# Altium project LAMP Microcontroller PCB.PrjPCB
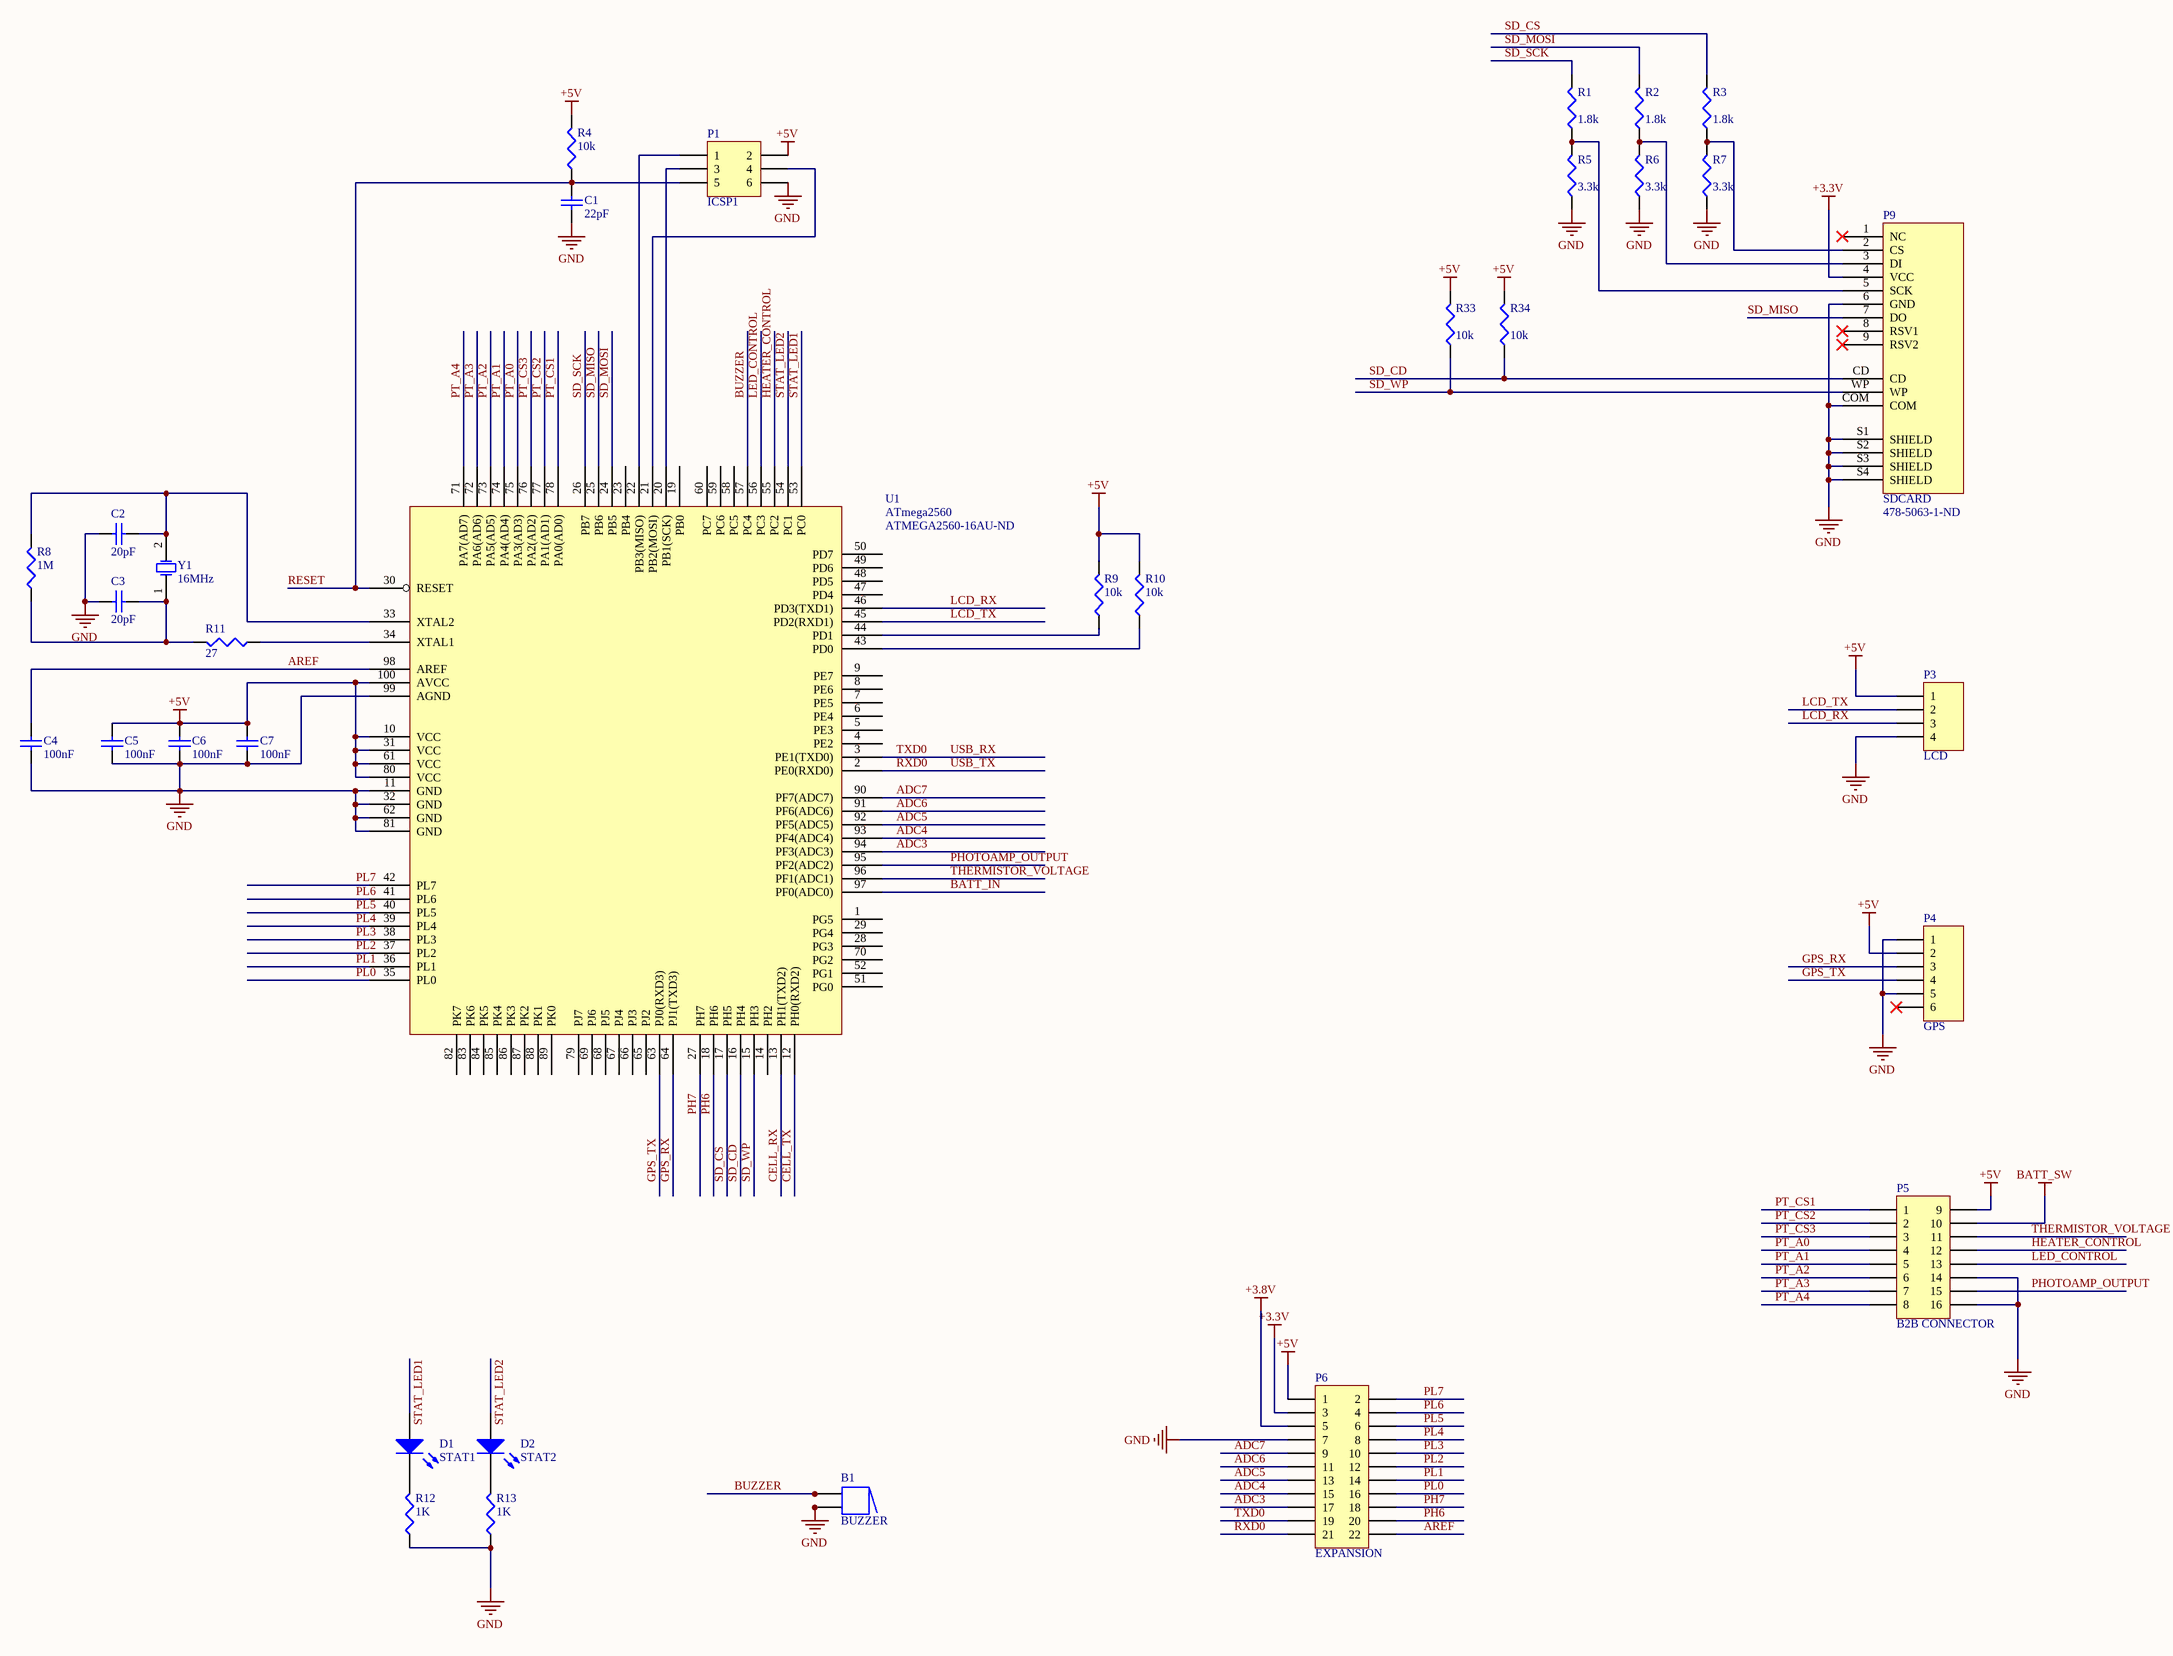
[diagram p0: Arduino Board.SchDoc]
4 sheets, 88 parts. Net scope: global (net labels, ports and power ports of the same name join across sheets).
Board file: Microcontroller PCB.PcbDoc
Sheets:
  Arduino Board.SchDoc
  Power Circuits.SchDoc
  Cell Phone Module.SchDoc
  USB Host.SchDoc

## Sheet Arduino Board.SchDoc
size C

### Parts
B1  BUZZER  [BUZZER]
C1  value 22pF  [C1206]  (hidden comment: Cap Semi)
C2  value 20pF  [C1206]  (hidden comment: Cap Semi)
C3  value 20pF  [C1206]  (hidden comment: Cap Semi)
C4  value 100nF  [C1206]  (hidden comment: Cap Semi)
C5  value 100nF  [C1206]  (hidden comment: Cap Semi)
C6  value 100nF  [C1206]  (hidden comment: Cap Semi)
C7  value 100nF  [C1206]  (hidden comment: Cap Semi)
D1  STAT1  [HDR1X2]
D2  STAT2  [HDR1X2]
P1  ICSP1  [HDR2X3]
P3  LCD  [2MM JST PH - 4 PIN]
P4  GPS  [2mm JST PH - 6 pin]
P5  B2B CONNECTOR  [HDR2X8_CEN]
P6  EXPANSION  [HDR2X11]
P9  SDCARD  Supplier Part Number 1: 478-5063-1-ND  [SDSLOT]
R1  value 1.8k  [RESC3216M]  (hidden comment: Res3)
R2  value 1.8k  [RESC3216M]  (hidden comment: Res3)
R3  value 1.8k  [RESC3216M]  (hidden comment: Res3)
R4  value 10k  [RESC3216M]  (hidden comment: Res3)
R5  value 3.3k  [RESC3216M]  (hidden comment: Res3)
R6  value 3.3k  [RESC3216M]  (hidden comment: Res3)
R7  value 3.3k  [RESC3216M]  (hidden comment: Res3)
R8  value 1M  [RESC3216M]  (hidden comment: Res3)
R9  value 10k  [RESC3216M]  (hidden comment: Res3)
R10  value 10k  [RESC3216M]  (hidden comment: Res3)
R11  value 27  [RESC3216M]  (hidden comment: Res3)
R12  value 1K  [RESC3216M]  (hidden comment: Res3)
R13  value 1K  [RESC3216M]  (hidden comment: Res3)
R33  value 10k  [RESC3216M]  (hidden comment: Res3)
R34  value 10k  [RESC3216M]  (hidden comment: Res3)
U1  ATmega2560  Supplier Part Number 1: ATMEGA2560-16AU-ND  [TSQFP50P1600X1600-100M]
Y1  16MHz  [SMT Crystal]

### Nets
+3.3V: P6.3 P9.4(VCC)
+3.8V: P6.5
+5V: C5.2 C6.2 C7.2 P1.2 P3.1 P4.2 P5.9 P6.1 R4.2 R9.2 R10.2 R33.2 R34.2 U1.10(VCC) U1.31(VCC) U1.61(VCC) U1.80(VCC) U1.100(AVCC)
BATT_SW: P5.10
GND: B1.2 B1.2A C1.1 C2.1 C3.2 C4.1 C5.1 C6.1 C7.1 P1.6 P3.4 P4.1 P4.5 P5.14 P5.16 P6.7 P9.6(GND) P9.COM P9.S1(SHIELD) P9.S2(SHIELD) P9.S3(SHIELD) P9.S4(SHIELD) R5.1 R6.1 R7.1 R12.1 R13.1 U1.11(GND) U1.32(GND) U1.62(GND) U1.81(GND) U1.99(AGND)
ADC3: P6.17 U1.94(PF3(ADC3))
ADC4: P6.15 U1.93(PF4(ADC4))
ADC5: P6.13 U1.92(PF5(ADC5))
ADC6: P6.11 U1.91(PF6(ADC6))
ADC7: P6.9 U1.90(PF7(ADC7))
AREF: C4.2 P6.22 U1.98(AREF)
BATT_IN: U1.97(PF0(ADC0))
BUZZER: B1.1 B1.1A U1.57(PC4)
CELL_RX: U1.13(PH1(TXD2))
CELL_TX: U1.12(PH0(RXD2))
GPS_RX: P4.3 U1.64(PJ1(TXD3))
GPS_TX: P4.4 U1.63(PJ0(RXD3))
HEATER_CONTROL: P5.12 U1.55(PC2)
LCD_RX: P3.3 U1.46(PD3(TXD1))
LCD_TX: P3.2 U1.45(PD2(RXD1))
LED_CONTROL: P5.13 U1.56(PC3)
PH6: P6.20 U1.18(PH6)
PH7: P6.18 U1.27(PH7)
PHOTOAMP_OUTPUT: P5.15 U1.95(PF2(ADC2))
PL0: P6.16 U1.35(PL0)
PL1: P6.14 U1.36(PL1)
PL2: P6.12 U1.37(PL2)
PL3: P6.10 U1.38(PL3)
PL4: P6.8 U1.39(PL4)
PL5: P6.6 U1.40(PL5)
PL6: P6.4 U1.41(PL6)
PL7: P6.2 U1.42(PL7)
PT_A0: P5.4 U1.75(PA3(AD3))
PT_A1: P5.5 U1.74(PA4(AD4))
PT_A2: P5.6 U1.73(PA5(AD5))
PT_A3: P5.7 U1.72(PA6(AD6))
PT_A4: P5.8 U1.71(PA7(AD7))
PT_CS1: P5.1 U1.78(PA0(AD0))
PT_CS2: P5.2 U1.77(PA1(AD1))
PT_CS3: P5.3 U1.76(PA2(AD2))
RESET: C1.2 P1.5 R4.1 U1.30(RESET)
RXD0: P6.21 U1.2(PE0(RXD0))  [also labelled USB_TX]
SD_CD: P9.CD R34.1 U1.16(PH4)
SD_CS: R3.2 U1.17(PH5)
SD_MISO: P9.7(DO) U1.25(PB6)
SD_MOSI: R2.2 U1.24(PB5)
SD_SCK: R1.2 U1.26(PB7)
SD_WP: P9.WP R33.1 U1.15(PH3)
STAT_LED1: D1.1(A) U1.53(PC0)
STAT_LED2: D2.1(A) U1.54(PC1)
THERMISTOR_VOLTAGE: P5.11 U1.96(PF1(ADC1))
TXD0: P6.19 U1.3(PE1(TXD0))  [also labelled USB_RX]
NetC2_2: C2.2 R8.2 U1.33(XTAL2) Y1.2(OSC2)
NetC3_1: C3.1 R8.1 R11.2 Y1.1(OSC1)
NetD1_2: D1.2(K) R12.2
NetD2_2: D2.2(K) R13.2
NetP1_1: P1.1 U1.22(PB3(MISO))
NetP1_3: P1.3 U1.20(PB1(SCK))
NetP1_4: P1.4 U1.21(PB2(MOSI))
NetP9_2: P9.2(CS) R3.1 R7.2
NetP9_3: P9.3(DI) R2.1 R6.2
NetP9_5: P9.5(SCK) R1.1 R5.2
NetR9_1: R9.1 U1.44(PD1)
NetR10_1: R10.1 U1.43(PD0)
NetR11_1: R11.1 U1.34(XTAL1)

Not connected (* = marked no-connect by the designer): P4 6*; P9 1(NC)* 8(RSV1)* 9(RSV2)*; U1 1(PG5) 4(PE2) 5(PE3) 6(PE4) 7(PE5) 8(PE6) 9(PE7) 14(PH2) 19(PB0) 23(PB4) 28(PG3) 29(PG4) 47(PD4) 48(PD5) 49(PD6) 50(PD7) 51(PG0) 52(PG1) 58(PC5) 59(PC6) 60(PC7) 65(PJ2) 66(PJ3) 67(PJ4) 68(PJ5) 69(PJ6) 70(PG2) 79(PJ7) 82(PK7) 83(PK6) 84(PK5) 85(PK4) 86(PK3) 87(PK2) 88(PK1) 89(PK0)

### Library data of the parts
B1 = Buzzer: Magnetic Transducer Buzzer; pin to pad: 1A>1 2A>2; Published: 24-Mar-1999; LatestRevisionDate: 17-Dec-2003; LatestRevisionNote: Schematic revised, PCB Footprint replaced.; DatasheetVersion: 17-Dec-2003; PackageReference: ABSM-1574; Publisher: Altium Limited; PackageDescription: Magnetic Transducer Buzzer; ComponentLink1Description: Manufacturer Link; ComponentLink1URL: http://www.megastar.com/linecard/buzzmode/index.php
C1-C7 = Cap Semi: Capacitor (Semiconductor SIM Model); Published: 8-Jun-2000; LatestRevisionDate: 29-May-2009; LatestRevisionNote: IPC-7351 Footprint Added.; PackageReference: C1206; Publisher: Altium Limited; PackageDescription: Chip Capacitor
D1 D2 = LED3: Typical BLUE SiC LED; Published: 8-Jun-2000; LatestRevisionDate: 17-Dec-2003; LatestRevisionNote: PCB Footprint replaced.; DatasheetVersion: 16-Apr-2002; PackageVersion: 16-Apr-2002; PackageReference: 3.5X2.8X1.9; Publisher: Altium Limited; PackageDescription: SM LED; 2 C-Bend Leads; Body 3.5 x 2.8 x 1.9 mm, inc leads (LxWxH typ)
P1 = Header 3X2: Header, 3-Pin, Dual row; LatestRevisionDate: 17-Jul-2002; LatestRevisionNote: Re-released for DXP Platform.; Publisher: Altium Limited
P3 = Header 4: Header, 4-Pin; LatestRevisionDate: 17-Jul-2002; LatestRevisionNote: Re-released for DXP Platform.; Publisher: Altium Limited
P4 = Header 6: Header, 6-Pin; LatestRevisionDate: 17-Jul-2002; LatestRevisionNote: Re-released for DXP Platform.; Publisher: Altium Limited
P5 = Header 8X2A: Header, 8-Pin, Dual row; LatestRevisionDate: 17-Jul-2002; LatestRevisionNote: Re-released for DXP Platform.; Publisher: Altium Limited
P6 = Header 11X2: Header, 11-Pin, Dual row; LatestRevisionDate: 17-Jul-2002; LatestRevisionNote: Re-released for DXP Platform.; Publisher: Altium Limited
P9 = SDSLOT: Supplier 1: Digi-Key
R1-R13 R33 R34 = Res3: Resistor; Published: 8-Jun-2000; LatestRevisionDate: 29-May-2009; LatestRevisionNote: IPC-7351 Footprint Added.; PackageReference: J1-0603; Publisher: Altium Limited; PackageDescription: Chip Resistor
Y1 = XTAL: Crystal Oscillator; Published: 8-Jun-2000; LatestRevisionDate: 17-Jul-2002; LatestRevisionNote: Re-released for DXP Platform.; PackageReference: R38; Publisher: Altium Limited; PackageDescription: Crystal, Thru-Hole; 2 Leads; Body 3.1 x 8.2 mm (Dia.xH)
U1 = ATmega2560: Supplier 1: Digi-Key

## Sheet Power Circuits.SchDoc
size A
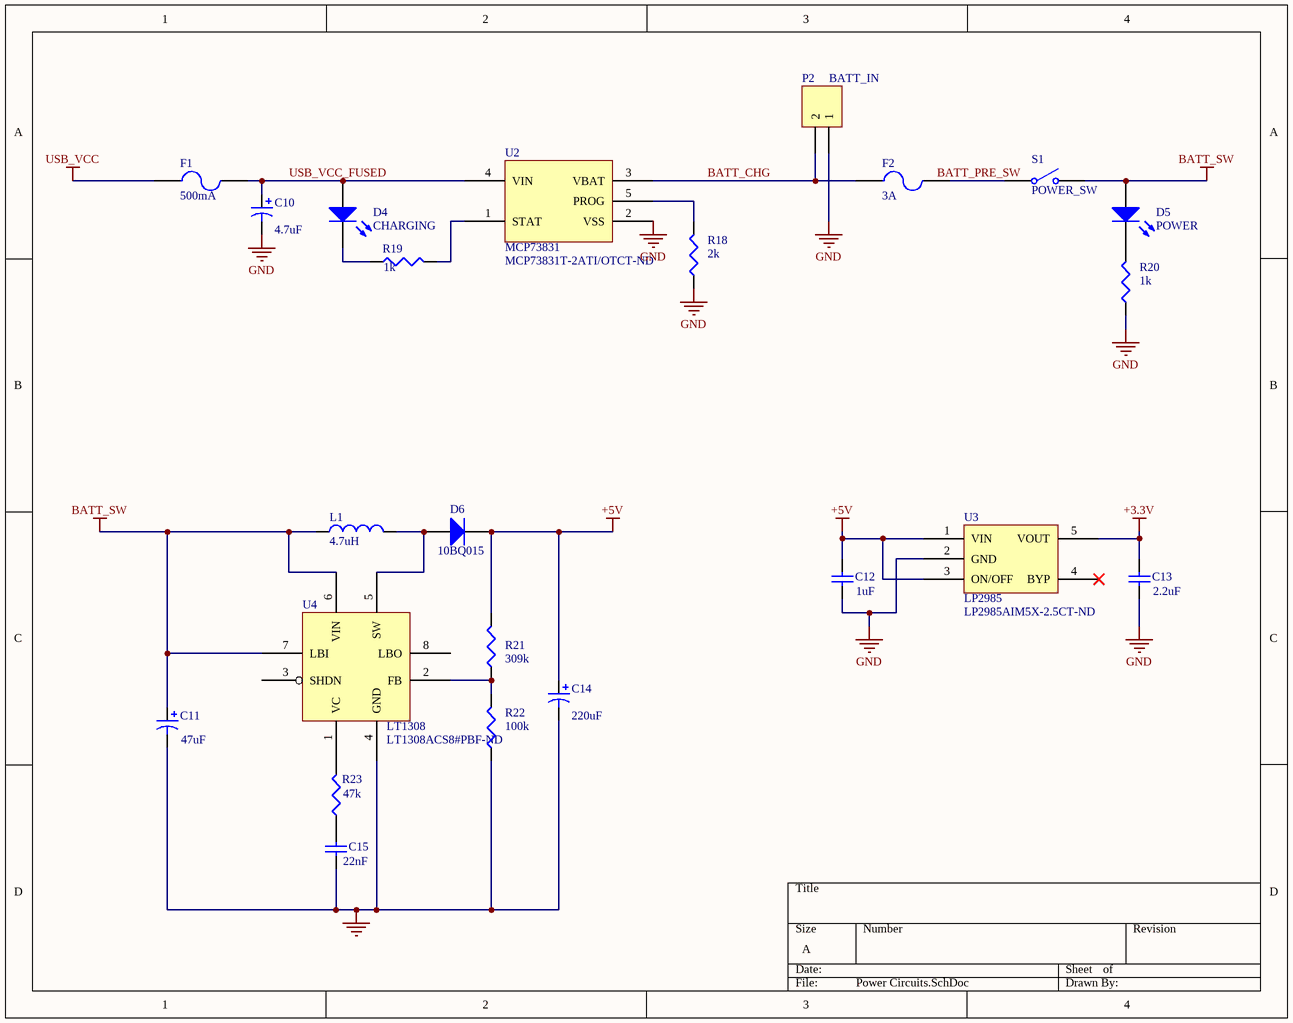
[diagram p1: Power Circuits.SchDoc]

### Parts
C10  value 4.7uF  [TC7343-2917]  (hidden comment: Cap Pol3)
C11  value 47uF  [TC6032-2412]  (hidden comment: Cap Pol3)
C12  value 1uF  [C1206]  (hidden comment: Cap Semi)
C13  value 2.2uF  [C1206]  (hidden comment: Cap Semi)
C14  value 220uF  [TC7343-2917]  (hidden comment: Cap Pol3)
C15  value 22nF  [C1206]  (hidden comment: Cap Semi)
D4  CHARGING  [HDR1X2]
D5  POWER  [HDR1X2]
D6  10BQ015  [DSO-C2/X2.3]
F1  500mA  [RESC3216M]
F2  3A  [RESC3216M]
L1  value 4.7uH  [MURATA SMT INDUCTOR]  (hidden comment: Inductor)
P2  BATT_IN  [2MM JST PH - 2 PIN VERT]
R18  value 2k  [RESC3216M]  (hidden comment: Res3)
R19  value 1k  [RESC3216M]  (hidden comment: Res3)
R20  value 1k  [RESC3216M]  (hidden comment: Res3)
R21  value 309k  [RESC3216M]  (hidden comment: Res3)
R22  value 100k  [RESC3216M]  (hidden comment: Res3)
R23  value 47k  [RESC3216M]  (hidden comment: Res3)
S1  POWER_SW  [DPDT_PUSHBUTTON_SWITCH]
U2  MCP73831  Supplier Part Number 1: MCP73831T-2ATI/OTCT-ND  [SOT23-5AM]
U3  LP2985  Supplier Part Number 1: LP2985AIM5X-2.5CT-ND  [SOT23-5AM]
U4  LT1308  Supplier Part Number 1: LT1308ACS8#PBF-ND  [SOIC127P600-8AM]

### Nets
+3.3V: C13.2 U3.5(VOUT)
+5V: C12.2 C14.1 D6.2(K) R21.2 U3.1(VIN) U3.3(ON/OFF)
BATT_SW: C11.1 D5.1(A) L1.1 S1.2(NO) U4.6(VIN) U4.7(LBI)
GND: C10.2 C11.2 C12.1 C13.1 C14.2 C15.1 P2.1 R18.1 R20.1 R22.1 U2.2(VSS) U3.2(GND) U4.4(GND)
USB_VCC: F1.1
BATT_CHG: F2.1 P2.2 U2.3(VBAT)
USB_VCC_FUSED: C10.1 D4.1(A) F1.2 U2.4(VIN)
NetC15_2: C15.2 R23.1
NetD4_2: D4.2(K) R19.1
NetD5_2: D5.2(K) R20.2
NetD6_1: D6.1(A) L1.2 U4.5(SW)
NetF2_2: F2.2 S1.1(COMMON)
NetR18_2: R18.2 U2.5(PROG)
NetR19_2: R19.2 U2.1(STAT)
NetR21_1: R21.1 R22.2 U4.2(FB)
NetR23_2: R23.2 U4.1(VC)

Not connected (* = marked no-connect by the designer): U3 4(BYP)*; U4 3(SHDN) 8(LBO)

### Notes on the sheet
- Labels drawn without touching a wire or pin: BATT_PRE_SW

### Library data of the parts
C10 C11 C14 = Cap Pol3: Polarized Capacitor (Surface Mount); Published: 8-Jun-2000; LatestRevisionDate: 29-May-2009; LatestRevisionNote: IPC-7351 Footprint Added.; PackageReference: C0805; Publisher: Altium Limited; PackageDescription: Chip Capacitor
C12 C13 C15 = Cap Semi: Capacitor (Semiconductor SIM Model); Published: 8-Jun-2000; LatestRevisionDate: 29-May-2009; LatestRevisionNote: IPC-7351 Footprint Added.; PackageReference: C1206; Publisher: Altium Limited; PackageDescription: Chip Capacitor
D4 D5 = LED3: Typical BLUE SiC LED; Published: 8-Jun-2000; LatestRevisionDate: 17-Dec-2003; LatestRevisionNote: PCB Footprint replaced.; DatasheetVersion: 16-Apr-2002; PackageVersion: 16-Apr-2002; PackageReference: 3.5X2.8X1.9; Publisher: Altium Limited; PackageDescription: SM LED; 2 C-Bend Leads; Body 3.5 x 2.8 x 1.9 mm, inc leads (LxWxH typ)
D6 = Diode: Default Diode; Published: 8-Jun-2000; LatestRevisionDate: 17-Jul-2002; LatestRevisionNote: Re-released for DXP Platform.; PackageVersion: Sep-1996; PackageReference: SMC; Publisher: Altium Limited; PackageDescription: DO-214-AB/SMC; 2 C-Bend Leads; Body 7.9 x 5.9 mm, inc. leads (LxW); Code_JEDEC: DO-214-AB
F1 F2 = Fuse 2: Fuse; Published: 8-Jun-2000; LatestRevisionDate: 17-Jul-2002; LatestRevisionNote: Re-released for DXP Platform.; PackageReference: PIN-W2/E2.8; Publisher: Altium Limited; PackageDescription: Thru-Hole; 2 Leads
L1 = Inductor: Code_IEC: 1005; Published: 8-Jun-2000; LatestRevisionDate: 29-May-2009; LatestRevisionNote: IPC-7351 Footprint Added.; PackageReference: 0402-A; Publisher: Altium Limited; PackageDescription: Chip Inductor; Code_JEITA: 0402
P2 = Header 2: Header, 2-Pin; LatestRevisionDate: 17-Jul-2002; LatestRevisionNote: Re-released for DXP Platform.; Publisher: Altium Limited
R18-R23 = Res3: Resistor; Published: 8-Jun-2000; LatestRevisionDate: 29-May-2009; LatestRevisionNote: IPC-7351 Footprint Added.; PackageReference: J1-0603; Publisher: Altium Limited; PackageDescription: Chip Resistor
S1 = SW-SPST: Single-Pole, Single-Throw Switch; pin to pad: 1>D 2>S2; Published: 24-Mar-1999; LatestRevisionDate: 17-Jul-2002; LatestRevisionNote: Re-released for DXP Platform.; PackageReference: SPST-2; Publisher: Altium Limited; PackageDescription: Switch; 2 Leads
U2 = MCP73831: Supplier 1: Digi-Key
U3 = LP2985: Supplier 1: Digi-Key
U4 = LT1308: Supplier 1: Digi-Key

## Sheet Cell Phone Module.SchDoc
size A
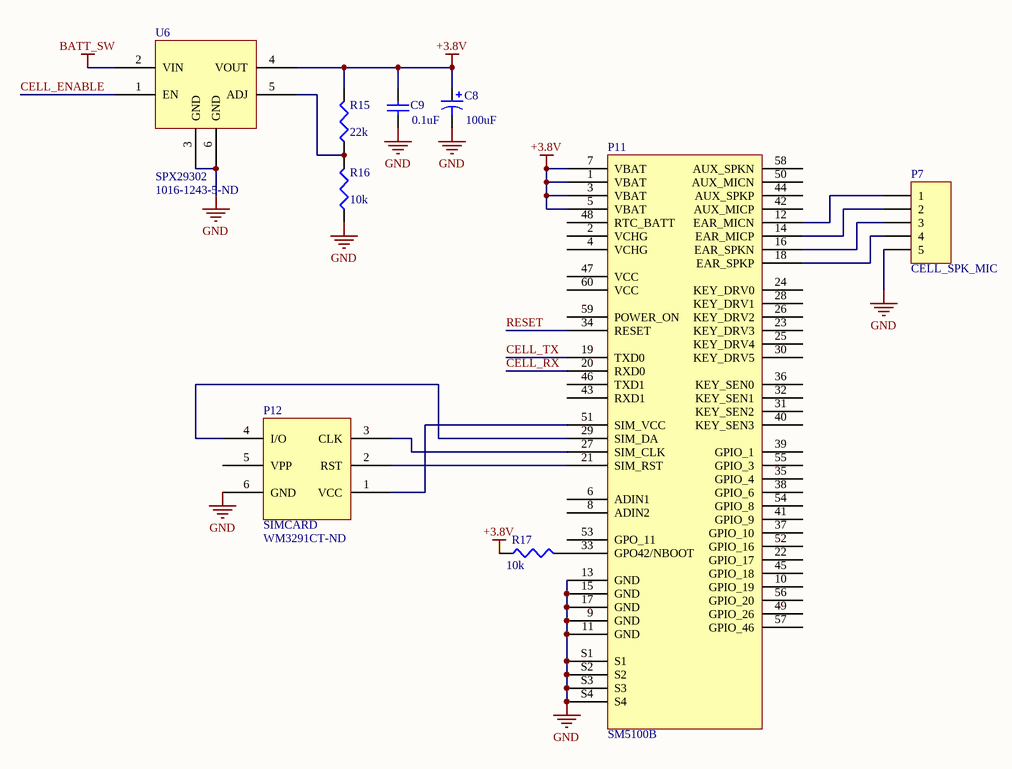
[diagram p2: Cell Phone Module.SchDoc]

### Parts
C8  value 100uF  [TC7343-2917]  (hidden comment: Cap Pol3)
C9  value 0.1uF  [C1206]  (hidden comment: Cap Semi)
P7  CELL_SPK_MIC  [2mm JST PH - 5 pin]
P11  SM5100B  [SM5100B-60PIN]
P12  SIMCARD  Supplier Part Number 1: WM3291CT-ND  [SIMSLOT]
R15  value 22k  [RESC3216M]  (hidden comment: Res3)
R16  value 10k  [RESC3216M]  (hidden comment: Res3)
R17  value 10k  [RESC3216M]  (hidden comment: Res3)
U6  SPX29302  Supplier Part Number 1: 1016-1243-5-ND  [TO170P1520-6N]

### Nets
+3.8V: C8.1 C9.2 P11.1(VBAT) P11.3(VBAT) P11.5(VBAT) P11.7(VBAT) R15.2 R17.1 U6.4(VOUT)
BATT_SW: U6.2(VIN)
GND: C8.2 C9.1 P7.5 P11.9(GND) P11.11(GND) P11.13(GND) P11.15(GND) P11.17(GND) P11.S1 P11.S2 P11.S3 P11.S4 P12.6(GND) R16.1 U6.3(GND) U6.6(GND)
CELL_ENABLE: U6.1(EN)
CELL_RX: P11.20(RXD0)
CELL_TX: P11.19(TXD0)
RESET: P11.34(RESET)
NetP7_1: P7.1 P11.12(EAR_MICN)
NetP7_2: P7.2 P11.14(EAR_MICP)
NetP7_3: P7.3 P11.16(EAR_SPKN)
NetP7_4: P7.4 P11.18(EAR_SPKP)
NetP11_21: P11.21(SIM_RST) P12.2(RST)
NetP11_27: P11.27(SIM_CLK) P12.3(CLK)
NetP11_29: P11.29(SIM_DA) P12.4(I/O)
NetP11_33: P11.33(GPO42/NBOOT) R17.2
NetP11_51: P11.51(SIM_VCC) P12.1(VCC)
NetR15_1: R15.1 R16.2 U6.5(ADJ)

Not connected (* = marked no-connect by the designer): P11 2(VCHG) 4(VCHG) 6(ADIN1) 8(ADIN2) 10(GPIO_19) 22(GPIO_17) 23(KEY_DRV3) 24(KEY_DRV0) 25(KEY_DRV4) 26(KEY_DRV2) 28(KEY_DRV1) 30(KEY_DRV5) 31(KEY_SEN2) 32(KEY_SEN1) 35(GPIO_4) 36(KEY_SEN0) 37(GPIO_10) 38(GPIO_6) 39(GPIO_1) 40(KEY_SEN3) 41(GPIO_9) 42(AUX_MICP) 43(RXD1) 44(AUX_SPKP) 45(GPIO_18) 46(TXD1) 47(VCC) 48(RTC_BATT) 49(GPIO_26) 50(AUX_MICN) 52(GPIO_16) 53(GPO_11) 54(GPIO_8) 55(GPIO_3) 56(GPIO_20) 57(GPIO_46) 58(AUX_SPKN) 59(POWER_ON) 60(VCC); P12 5(VPP)

### Library data of the parts
C8 = Cap Pol3: Polarized Capacitor (Surface Mount); Published: 8-Jun-2000; LatestRevisionDate: 29-May-2009; LatestRevisionNote: IPC-7351 Footprint Added.; PackageReference: C0805; Publisher: Altium Limited; PackageDescription: Chip Capacitor
C9 = Cap Semi: Capacitor (Semiconductor SIM Model); Published: 8-Jun-2000; LatestRevisionDate: 29-May-2009; LatestRevisionNote: IPC-7351 Footprint Added.; PackageReference: C1206; Publisher: Altium Limited; PackageDescription: Chip Capacitor
P7 = Header 5: Header, 5-Pin; LatestRevisionDate: 17-Jul-2002; LatestRevisionNote: Re-released for DXP Platform.; Publisher: Altium Limited
P12 = SIMHOLDER: Supplier 1: Digi-Key
R15-R17 = Res3: Resistor; Published: 8-Jun-2000; LatestRevisionDate: 29-May-2009; LatestRevisionNote: IPC-7351 Footprint Added.; PackageReference: J1-0603; Publisher: Altium Limited; PackageDescription: Chip Resistor
U6 = SPX29302: Supplier 1: Digi-Key

## Sheet USB Host.SchDoc
size A
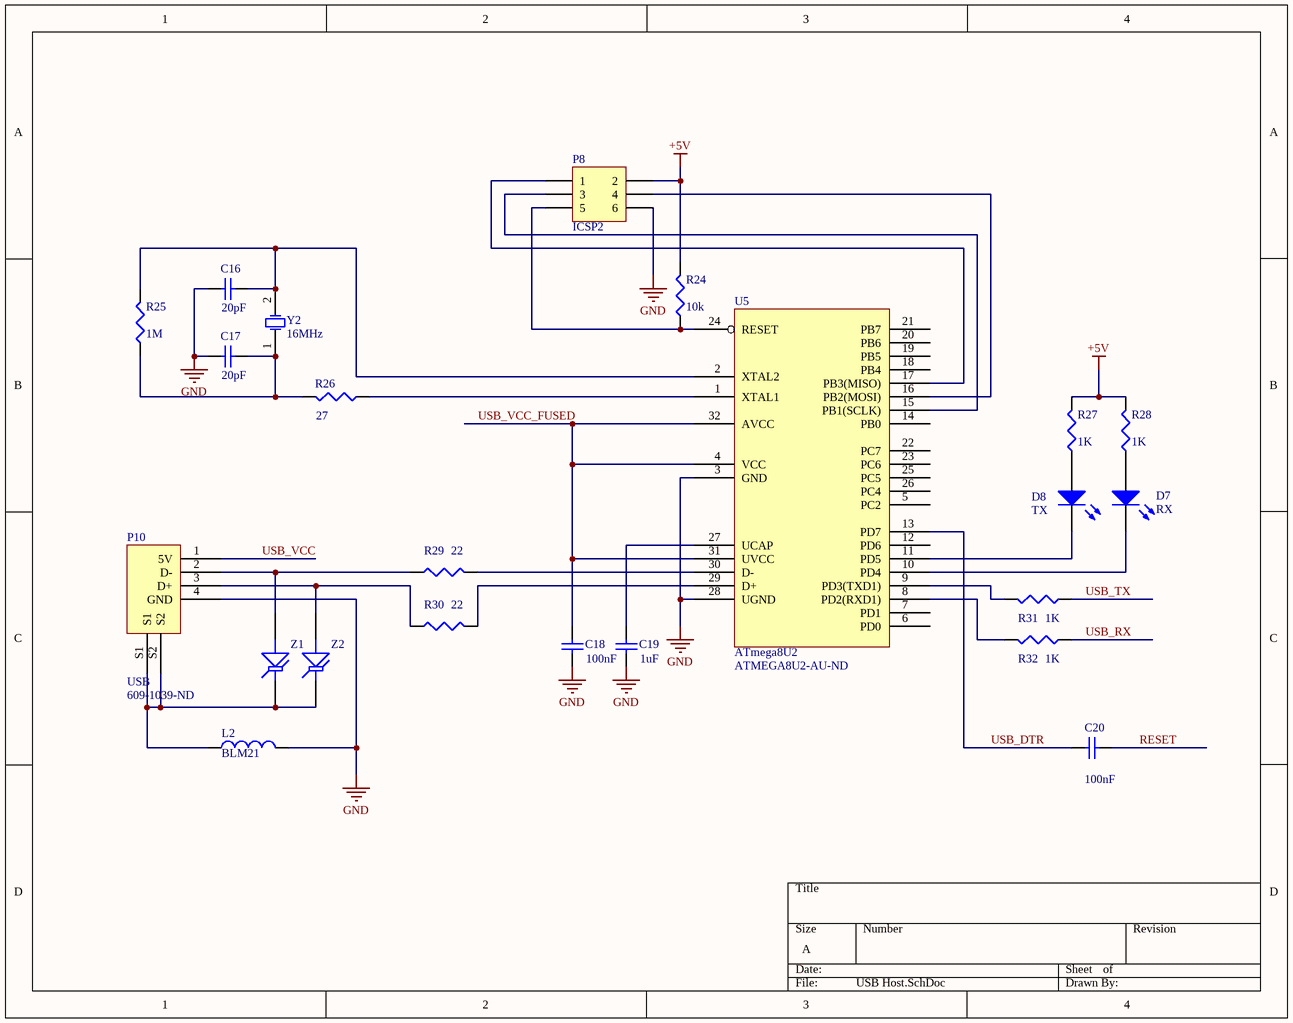
[diagram p3: USB Host.SchDoc]

### Parts
C16  value 20pF  [C1206]  (hidden comment: Cap Semi)
C17  value 20pF  [C1206]  (hidden comment: Cap Semi)
C18  value 100nF  [C1206]  (hidden comment: Cap Semi)
C19  value 1uF  [C1206]  (hidden comment: Cap Semi)
C20  value 100nF  [C1206]  (hidden comment: Cap Semi)
D7  RX  [HDR1X2]
D8  TX  [HDR1X2]
L2  value BLM21  [INDC2012M]  (hidden comment: Inductor)
P8  ICSP2  [HDR2X3]
P10  USB  Supplier Part Number 1: 609-1039-ND  [USB-B PN61729]
R24  value 10k  [RESC3216M]  (hidden comment: Res3)
R25  value 1M  [RESC3216M]  (hidden comment: Res3)
R26  value 27  [RESC3216M]  (hidden comment: Res3)
R27  value 1K  [RESC3216M]  (hidden comment: Res3)
R28  value 1K  [RESC3216M]  (hidden comment: Res3)
R29  value 22  [RESC3216M]  (hidden comment: Res3)
R30  value 22  [RESC3216M]  (hidden comment: Res3)
R31  value 1K  [RESC3216M]  (hidden comment: Res3)
R32  value 1K  [RESC3216M]  (hidden comment: Res3)
U5  ATmega8U2  Supplier Part Number 1: ATMEGA8U2-AU-ND  [QFP80P900X900-32M]
Y2  16MHz  [SMT Crystal]
Z1  Tranzorb  [CD1608-0603]  (value not drawn)
Z2  Tranzorb  [CD1608-0603]  (value not drawn)

### Nets
+5V: P8.2 R24.2 R27.2 R28.2
GND: C16.1 C17.2 C18.1 C19.1 L2.2 P8.6 P10.4(GND) U5.3(GND) U5.28(UGND)
USB_VCC: P10.1(5V)
RESET: C20.2
USB_DTR: C20.1 U5.13(PD7)
USB_RX: R32.1  [project net TXD0]
USB_TX: R31.1  [project net RXD0]
USB_VCC_FUSED: C18.2 U5.4(VCC) U5.31(UVCC) U5.32(AVCC)
NetC16_2: C16.2 R25.2 U5.2(XTAL2) Y2.2(OSC2)
NetC17_1: C17.1 R25.1 R26.2 Y2.1(OSC1)
NetC19_2: C19.2 U5.27(UCAP)
NetD7_1: D7.1(A) R28.1
NetD7_2: D7.2(K) U5.10(PD4)
NetD8_1: D8.1(A) R27.1
NetD8_2: D8.2(K) U5.11(PD5)
NetL2_1: L2.1 P10.S1 P10.S2 Z1.2(K) Z2.2(K)
NetP8_1: P8.1 U5.17(PB3(MISO))
NetP8_3: P8.3 U5.15(PB1(SCLK))
NetP8_4: P8.4 U5.16(PB2(MOSI))
NetP8_5: P8.5 R24.1 U5.24(RESET)
NetP10_2: P10.2(D-) R29.1 Z1.1(A)
NetP10_3: P10.3(D+) R30.1 Z2.1(A)
NetR26_1: R26.1 U5.1(XTAL1)
NetR29_2: R29.2 U5.30(D-)
NetR30_2: R30.2 U5.29(D+)
NetR31_2: R31.2 U5.9(PD3(TXD1))
NetR32_2: R32.2 U5.8(PD2(RXD1))

Not connected (* = marked no-connect by the designer): U5 5(PC2) 6(PD0) 7(PD1) 12(PD6) 14(PB0) 18(PB4) 19(PB5) 20(PB6) 21(PB7) 22(PC7) 23(PC6) 25(PC5) 26(PC4)

### Library data of the parts
C16-C20 = Cap Semi: Capacitor (Semiconductor SIM Model); Published: 8-Jun-2000; LatestRevisionDate: 29-May-2009; LatestRevisionNote: IPC-7351 Footprint Added.; PackageReference: C1206; Publisher: Altium Limited; PackageDescription: Chip Capacitor
D7 D8 = LED3: Typical BLUE SiC LED; Published: 8-Jun-2000; LatestRevisionDate: 17-Dec-2003; LatestRevisionNote: PCB Footprint replaced.; DatasheetVersion: 16-Apr-2002; PackageVersion: 16-Apr-2002; PackageReference: 3.5X2.8X1.9; Publisher: Altium Limited; PackageDescription: SM LED; 2 C-Bend Leads; Body 3.5 x 2.8 x 1.9 mm, inc leads (LxWxH typ)
L2 = Inductor: Code_IEC: 1005; Published: 8-Jun-2000; LatestRevisionDate: 29-May-2009; LatestRevisionNote: IPC-7351 Footprint Added.; PackageReference: 0402-A; Publisher: Altium Limited; PackageDescription: Chip Inductor; Code_JEITA: 0402
P8 = Header 3X2: Header, 3-Pin, Dual row; LatestRevisionDate: 17-Jul-2002; LatestRevisionNote: Re-released for DXP Platform.; Publisher: Altium Limited
R24-R32 = Res3: Resistor; Published: 8-Jun-2000; LatestRevisionDate: 29-May-2009; LatestRevisionNote: IPC-7351 Footprint Added.; PackageReference: J1-0603; Publisher: Altium Limited; PackageDescription: Chip Resistor
Y2 = XTAL: Crystal Oscillator; Published: 8-Jun-2000; LatestRevisionDate: 17-Jul-2002; LatestRevisionNote: Re-released for DXP Platform.; PackageReference: R38; Publisher: Altium Limited; PackageDescription: Crystal, Thru-Hole; 2 Leads; Body 3.1 x 8.2 mm (Dia.xH)
Z1 Z2 = Tranzorb: Transient Voltage Suppression (TVS) Diode; Published: 24-Mar-1999; LatestRevisionDate: 17-Jul-2002; LatestRevisionNote: Re-released for DXP Platform.; PackageReference: DO-7; Publisher: Altium Limited; PackageDescription: Axial Lead Diode
P10 = USB: Supplier 1: Digi-Key
U5 = ATmega8U2: Supplier 1: Digi-Key

## Nets that join several sheets
+3.3V: Arduino Board (P6.3 P9.4), Power Circuits (C13.2 U3.5)
+3.8V: Arduino Board (P6.5), Cell Phone Module (9 pins)
+5V: Arduino Board (18 pins), Power Circuits (6 pins), USB Host (P8.2 R24.2 R27.2 R28.2)
BATT_SW: Arduino Board (P5.10), Power Circuits (6 pins), Cell Phone Module (U6.2)
GND: Arduino Board (32 pins), Power Circuits (13 pins), Cell Phone Module (16 pins), USB Host (9 pins)
USB_VCC: Power Circuits (F1.1), USB Host (P10.1)
CELL_RX: Arduino Board (U1.13), Cell Phone Module (P11.20)
CELL_TX: Arduino Board (U1.12), Cell Phone Module (P11.19)
RESET: Arduino Board (C1.2 P1.5 R4.1 U1.30), Cell Phone Module (P11.34), USB Host (C20.2)
RXD0: Arduino Board (P6.21 U1.2), USB Host (R31.1)
TXD0: Arduino Board (P6.19 U1.3), USB Host (R32.1)
USB_VCC_FUSED: Power Circuits (C10.1 D4.1 F1.2 U2.4), USB Host (C18.2 U5.4 U5.31 U5.32)